# Altium project ESC 2.0.PrjPcb
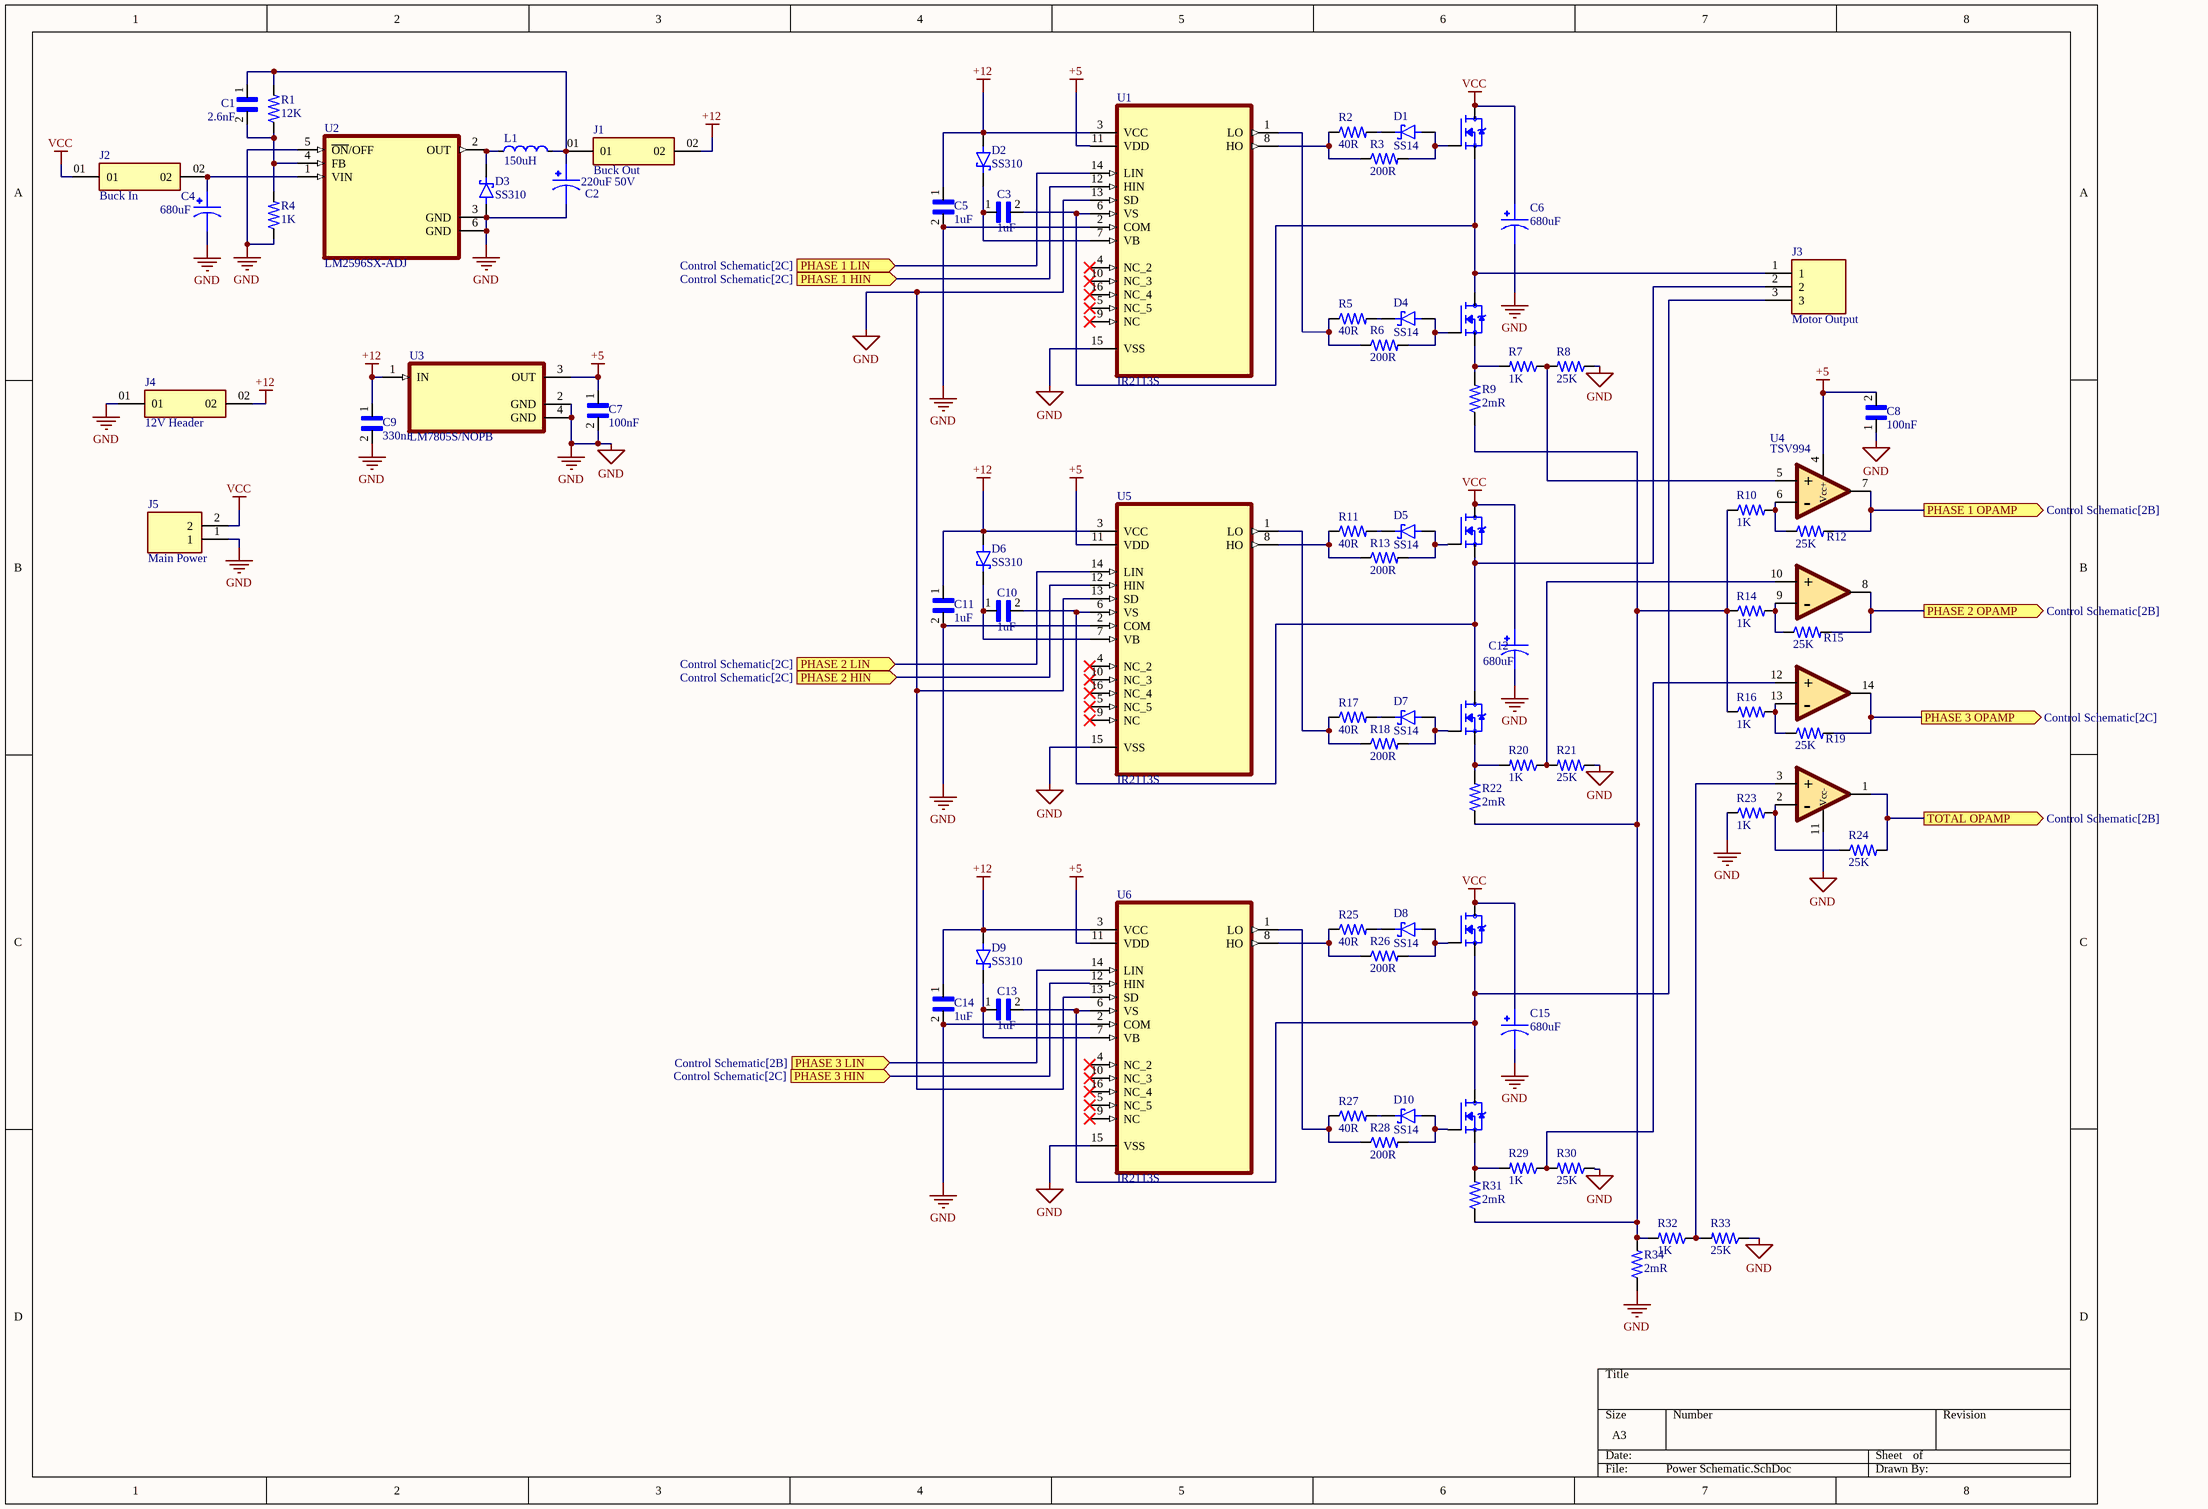
[diagram p0: Power Schematic.SchDoc]
2 sheets, 99 parts. Net scope: flat (ports and power ports of the same name join across sheets).
Board file: ESC PCB.PcbDoc
Sheets:
  Power Schematic.SchDoc
  Control Schematic.SchDoc

## Sheet Power Schematic.SchDoc
size A3; SheetNumber: 1; SheetTotal: 2

### Parts
C1  2.6nF  [0603 Footprint]
C2  220uF 50V  [CAPAE1030X1080N_UWT1H221MNL1GS]
C3  1uF  [0603 Footprint]
C4  680uF  [CAPPRD750W80D1600H2500]
C5  1uF  [0603 Footprint]
C6  680uF  [CAPPRD750W80D1600H2500]
C7  100nF  [0603 Footprint]
C8  100nF  [0603 Footprint]
C9  330nF  [0603 Footprint]
C10  1uF  [0603 Footprint]
C11  1uF  [0603 Footprint]
C12  680uF  [CAPPRD750W80D1600H2500]
C13  1uF  [0603 Footprint]
C14  1uF  [0603 Footprint]
C15  680uF  [CAPPRD750W80D1600H2500]
D1  SS14  [DIOM4325X250N]
D2  SS310  [DIO_SS310]
D3  SS310  [DIO_SS310]
D4  SS14  [DIOM4325X250N]
D5  SS14  [DIOM4325X250N]
D6  SS310  [DIO_SS310]
D7  SS14  [DIOM4325X250N]
D8  SS14  [DIOM4325X250N]
D9  SS310  [DIO_SS310]
D10  SS14  [DIOM4325X250N]
J1  Buck Out  [SAMTEC_MTMM-101-10-G-D-135]
J2  Buck In  [SAMTEC_MTMM-101-10-G-D-135]
J3  Motor Output  [PHOENIX_MKDSN2,5/3-5.08]
J4  12V Header  [SAMTEC_MTMM-101-10-G-D-135]
J5  Main Power  [PHOENIX_1729128]
L1  150uH  [SMD 15x15]
Q1  IRF540NPBF  [TO254P1054X469X1930-3]  (value not drawn)
Q2  IRF540NPBF  [TO254P1054X469X1930-3]  (value not drawn)
Q3  IRF540NPBF  [TO254P1054X469X1930-3]  (value not drawn)
Q4  IRF540NPBF  [TO254P1054X469X1930-3]  (value not drawn)
Q5  IRF540NPBF  [TO254P1054X469X1930-3]  (value not drawn)
Q6  IRF540NPBF  [TO254P1054X469X1930-3]  (value not drawn)
R1  12K  [0603 Footprint]
R2  40R  [0603 Footprint]
R3  200R  [0603 Footprint]
R4  1K  [0603 Footprint]
R5  40R  [0603 Footprint]
R6  200R  [0603 Footprint]
R7  1K  [0603 Footprint]
R8  25K  [0603 Footprint]
R9  2mR  [2512 Footprint]
R10  1K  [0603 Footprint]
R11  40R  [0603 Footprint]
R12  25K  [0603 Footprint]
R13  200R  [0603 Footprint]
R14  1K  [0603 Footprint]
R15  25K  [0603 Footprint]
R16  1K  [0603 Footprint]
R17  40R  [0603 Footprint]
R18  200R  [0603 Footprint]
R19  25K  [0603 Footprint]
R20  1K  [0603 Footprint]
R21  25K  [0603 Footprint]
R22  2mR  [2512 Footprint]
R23  1K  [0603 Footprint]
R24  25K  [0603 Footprint]
R25  40R  [0603 Footprint]
R26  200R  [0603 Footprint]
R27  40R  [0603 Footprint]
R28  200R  [0603 Footprint]
R29  1K  [0603 Footprint]
R30  25K  [0603 Footprint]
R31  2mR  [2512 Footprint]
R32  1K  [0603 Footprint]
R33  25K  [0603 Footprint]
R34  2mR  [2512 Footprint]
U1  IR2113S  [IR2113S]
U2  LM2596SX-ADJ  [VREG_LM2596SX-ADJ]
U3  LM7805S/NOPB  [TO254P1524X483-4N]
U4  TSV994  [TSV994IDT]
U5  IR2113S  [IR2113S]
U6  IR2113S  [IR2113S]

### Ports
PHASE 1 HIN (in, see Control Schematic[2C]), PHASE 1 LIN (in, see Control Schematic[2C]), PHASE 1 OPAMP (out, see Control Schematic[2B]), PHASE 2 HIN (in, see Control Schematic[2C]), PHASE 2 LIN (in, see Control Schematic[2C]), PHASE 2 OPAMP (out, see Control Schematic[2B]), PHASE 3 HIN (in, see Control Schematic[2C]), PHASE 3 LIN (in, see Control Schematic[2B]), PHASE 3 OPAMP (out, see Control Schematic[2C]), TOTAL OPAMP (out, see Control Schematic[2B])

### Nets
+5: C7.1 C8.2 U1.11(VDD) U3.3(OUT) U4.4(Vcc+) U5.11(VDD) U6.11(VDD)
+12: C5.1 C9.1 C11.1 C14.1 D2.A D6.A D9.A J1.02 J4.02 U1.3(VCC) U3.1(IN) U5.3(VCC) U6.3(VCC)
GND: C2.2 C4.2 C5.2 C6.2 C7.2 C8.1 C9.2 C11.2 C12.2 C14.2 C15.2 D3.A J4.01 J5.1 R4.1 R8.1 R21.1 R23.1 R30.1 R33.1 R34.1 U1.2(COM) U1.13(SD) U1.15(VSS) U2.3(GND) U2.5(~{ON}/OFF) U2.6(GND) U3.2(GND) U3.4(GND) U4.11(Vcc-) U5.2(COM) U5.13(SD) U5.15(VSS) U6.2(COM) U6.13(SD) U6.15(VSS)
VCC: C6.1 C12.1 C15.1 J2.01 J5.2 Q1.2(D) Q3.2(D) Q5.2(D)
NetC1_1: C1.1 C2.1 J1.01 L1.2 R1.2
NetC1_2: C1.2 R1.1 R4.2 U2.4(FB)
NetC3_1: C3.1 D2.C(K) U1.7(VB)
NetC3_2: C3.2 J3.1 Q1.3(S) Q2.2(D) U1.6(VS)
NetC4_1: C4.1 J2.02 U2.1(VIN)
NetC10_1: C10.1 D6.C(K) U5.7(VB)
NetC10_2: C10.2 J3.2 Q3.3(S) Q4.2(D) U5.6(VS)
NetC13_1: C13.1 D9.C(K) U6.7(VB)
NetC13_2: C13.2 J3.3 Q5.3(S) Q6.2(D) U6.6(VS)
NetD1_A: D1.A Q1.1(G) R3.2
NetD1_C: D1.C(K) R2.2
NetD3_C: D3.C(K) L1.1 U2.2(OUT)
NetD4_A: D4.A Q2.1(G) R6.2
NetD4_C: D4.C(K) R5.2
NetD5_A: D5.A Q3.1(G) R13.2
NetD5_C: D5.C(K) R11.2
NetD7_A: D7.A Q4.1(G) R18.2
NetD7_C: D7.C(K) R17.2
NetD8_A: D8.A Q5.1(G) R26.2
NetD8_C: D8.C(K) R25.2
NetD10_A: D10.A Q6.1(G) R28.2
NetD10_C: D10.C(K) R27.2
NetQ2_3: Q2.3(S) R7.2 R9.2
NetQ4_3: Q4.3(S) R20.2 R22.2
NetQ6_3: Q6.3(S) R29.2 R31.2
NetR2_1: R2.1 R3.1 U1.8(HO)
NetR5_1: R5.1 R6.1 U1.1(LO)
NetR7_1: R7.1 R8.2 U4.5(+)
NetR9_1: R9.1 R10.1 R14.1 R16.1 R22.1 R31.1 R32.2 R34.2
NetR10_2: R10.2 R12.1 U4.6(-)
NetR11_1: R11.1 R13.1 U5.8(HO)
NetR12_2: R12.2 U4.7(Out) ; port PHASE 1 OPAMP
NetR14_2: R14.2 R15.1 U4.9(-)
NetR15_2: R15.2 U4.8(Out) ; port PHASE 2 OPAMP
NetR16_2: R16.2 R19.1 U4.13(-)
NetR17_1: R17.1 R18.1 U5.1(LO)
NetR19_2: R19.2 U4.14(Out) ; port PHASE 3 OPAMP
NetR20_1: R20.1 R21.2 U4.10(+)
NetR23_2: R23.2 R24.1 U4.2(-)
NetR24_2: R24.2 U4.1(Out) ; port TOTAL OPAMP
NetR25_1: R25.1 R26.1 U6.8(HO)
NetR27_1: R27.1 R28.1 U6.1(LO)
NetR29_1: R29.1 R30.2 U4.12(+)
NetR32_1: R32.1 R33.2 U4.3(+)
NetU1_12: U1.12(HIN) ; port PHASE 1 HIN
NetU1_14: U1.14(LIN) ; port PHASE 1 LIN
NetU5_12: U5.12(HIN) ; port PHASE 2 HIN
NetU5_14: U5.14(LIN) ; port PHASE 2 LIN
NetU6_12: U6.12(HIN) ; port PHASE 3 HIN
NetU6_14: U6.14(LIN) ; port PHASE 3 LIN

Not connected (* = marked no-connect by the designer): U1 4(NC_2)* 5(NC_5)* 9(NC)* 10(NC_3)* 16(NC_4)*; U5 4(NC_2)* 5(NC_5)* 9(NC)* 10(NC_3)* 16(NC_4)*; U6 4(NC_2)* 5(NC_5)* 9(NC)* 10(NC_3)* 16(NC_4)*

### Library data of the parts
C1 = 2.6nF: 2.6nF 0603; MP: CL10A105KA8NNNC; MF: Samsung Electro-Mechanics; Arrow_Electronics-Purchase-URL: https://snapeda.com/shop?store=Arrow+Electronics&id=3597973; Value: *; Arrow_Europe-Purchase-URL: https://snapeda.com/shop?store=Arrow+Europe&id=3597973; SnapEDA_Link: https://www.snapeda.com/parts/CL10A105KA8NNNC/Samsung%20Electro-Mechanics/view-part/3597973/?ref=snap; Digi-Key_Part_Number: 1276-1102-1-ND; Package: 0603 Samsung; DigiKey-Purchase-URL: https://snapeda.com/shop?store=DigiKey&id=3597973
C2 = 220uF 50V: 220ÂµF 50V Aluminum Electrolytic Capacitors Radial, Can - SMD 1000 Hrs @ 105Â°C; MF: Nichicon; MP: UWT1H221MNL1GS; Package: Radial Nichicon; Price: None; Availability: Unavailable; SnapEDA_Link: https://www.snapeda.com/parts/UWT1H221MNL1GS/Nichicon/view-part/566503/?ref=snap; Value: *
C3 C5 C10 C11 C13 C14 = 1uF: 1ÂµF Â±10% 25V Ceramic Capacitor X5R 0603 (1608 Metric); MP: CL10A105KA8NNNC; MF: Samsung Electro-Mechanics; Arrow_Electronics-Purchase-URL: https://snapeda.com/shop?store=Arrow+Electronics&id=3597973; Value: *; Arrow_Europe-Purchase-URL: https://snapeda.com/shop?store=Arrow+Europe&id=3597973; SnapEDA_Link: https://www.snapeda.com/parts/CL10A105KA8NNNC/Samsung%20Electro-Mechanics/view-part/3597973/?ref=snap; Digi-Key_Part_Number: 1276-1102-1-ND; Package: 0603 Samsung; DigiKey-Purchase-URL: https://snapeda.com/shop?store=DigiKey&id=3597973
C4 C6 C12 C15 = 680uF: 680uF 100V 64mΩ@100kHz ±20% 1.41A@100kHz. Aluminum Electrolytic; MP: 478CKS010M; MF: Illinois Capacitor; SnapEDA_Link: https://www.snapeda.com/parts/478CKS010M/Illinois%20Capacitor/view-part/2347563/?ref=snap; Price: None; Mouser-Purchase-URL: https://snapeda.com/shop?store=Mouser&id=2347563; Availability: Warning; Package: Radial Illinois Capacitor; Value: *
C7 C8 = 100nF: 0.1ÂµF Â±10% 50V Ceramic Capacitor X7R 0603 _1608 Metric_; MP: CL10B104KB8NNNC; MF: Samsung Electro-Mechanics; Price: None; SnapEDA_Link: https://www.snapeda.com/parts/CL10B104KB8NNNC/Samsung%20Electro-Mechanics/view-part/3598309/?ref=snap; Availability: Unavailable; Package: 0603 Samsung; Value: *
C9 = 330nF: 330nF 0603; MP: CL10B104KB8NNNC; MF: Samsung Electro-Mechanics; Price: None; SnapEDA_Link: https://www.snapeda.com/parts/CL10B104KB8NNNC/Samsung%20Electro-Mechanics/view-part/3598309/?ref=snap; Availability: Unavailable; Package: 0603 Samsung; Value: *
D2 D3 D6 D9 = SS310: 3A, 100V, Schottky Rectifier; MF: Taiwan Semiconductor; SnapEDA_Link: https://www.snapeda.com/parts/SS310/Taiwan+Semiconductor/view-part/?ref=snap; Package: DO-214AB-2 Taiwan Semiconductor; Value: *; MP: SS310; Check_prices: https://www.snapeda.com/parts/SS310/Taiwan+Semiconductor/view-part/?ref=eda
J1 J2 J4 = 2 Pin Header: Connector Header Through Hole 2 position; MF: Samtec; MP: MTMM-101-10-G-D-135; Availability: In Stock; Value: *; Price: None; Check_prices: https://www.snapeda.com/parts/MTMM-101-10-G-D-135/Samtec/view-part/?ref=eda; Package: None; Purchase-URL: https://pricing.snapeda.com/search/part/MTMM-101-10-G-D-135/?ref=eda; SnapEDA_Link: https://www.snapeda.com/parts/MTMM-101-10-G-D-135/Samtec/view-part/?ref=snap
J3 = 3 Pin Screw Header: HEADER, PCB, SCREW, 5.08MM, 3WAY; Connector Type: PCB; Series: MKDSN 2, 5; Connector Mounting: PCB; Pitch Spacing: 5....; MP: MKDSN2,5/3-5.08; MF: Phoenix Contact; Availability: Not in stock; SnapEDA_Link: https://www.snapeda.com/parts/MKDSN2,5/3-5.08/Phoenix+Contact/view-part/?ref=snap; Package: None; Check_prices: https://www.snapeda.com/parts/MKDSN2,5/3-5.08/Phoenix+Contact/view-part/?ref=eda; Value: *; Price: None
J5 = 2 Pin Screw Header: MF: {'manufacturer': u'Phoenix Contact'}; MP: 1729128; Package: None; Price: None; Value: *; Availability: Unavailable
L1 = 150uH: 150uH Power Inductor / SMD 15mm x 15mm
Q1-Q6 = IRF540NPBF: RoHS Compliant | Low RDS(on) | Industry-leading quality | Dynamic dv/dt Rating | Fast Switching | Fully Avalanche Rated | 175C Operating Temperature; MF: Infineon; SnapEDA_Link: https://www.snapeda.com/parts/IRF540NPBF/Infineon+Technologies/view-part/?ref=snap; Availability: In Stock; MP: IRF540NPBF; Purchase-URL: https://pricing.snapeda.com/search/part/IRF540NPBF/?ref=eda; Price: None; Value: *; Check_prices: https://www.snapeda.com/parts/IRF540NPBF/Infineon+Technologies/view-part/?ref=eda; Package: TO-220 Infineon
R1 = 12K: 12K 0603; MF: Yageo; MP: RC0603FR-071KL; SnapEDA_Link: https://www.snapeda.com/parts/RC0603FR-071KL/Yageo/view-part/?ref=snap; Package: 0603 Yageo; Value: *; Check_prices: https://www.snapeda.com/parts/RC0603FR-071KL/Yageo/view-part/?ref=eda
R2 R5 R11 R17 R25 R27 = 40R: 40R 0603; MF: Yageo; MP: RC0603FR-071KL; SnapEDA_Link: https://www.snapeda.com/parts/RC0603FR-071KL/Yageo/view-part/?ref=snap; Package: 0603 Yageo; Value: *; Check_prices: https://www.snapeda.com/parts/RC0603FR-071KL/Yageo/view-part/?ref=eda
R3 R6 R13 R18 R26 R28 = 200R: 200R 0603; MF: Yageo; MP: RC0603FR-071KL; SnapEDA_Link: https://www.snapeda.com/parts/RC0603FR-071KL/Yageo/view-part/?ref=snap; Package: 0603 Yageo; Value: *; Check_prices: https://www.snapeda.com/parts/RC0603FR-071KL/Yageo/view-part/?ref=eda
R4 R7 R10 R14 R16 R20 R23 R29 R32 = 1K: 1 kOhms Â±1% 0.1W, 1/10W Chip Resistor 0603 (1608 Metric) Moisture Resistant Thick Film; MF: Yageo; MP: RC0603FR-071KL; SnapEDA_Link: https://www.snapeda.com/parts/RC0603FR-071KL/Yageo/view-part/?ref=snap; Package: 0603 Yageo; Value: *; Check_prices: https://www.snapeda.com/parts/RC0603FR-071KL/Yageo/view-part/?ref=eda
R8 R12 R15 R19 R21 R24 R30 R33 = 25K: 25K Ohm 0603; MF: Yageo; MP: RC0603FR-071KL; SnapEDA_Link: https://www.snapeda.com/parts/RC0603FR-071KL/Yageo/view-part/?ref=snap; Package: 0603 Yageo; Value: *; Check_prices: https://www.snapeda.com/parts/RC0603FR-071KL/Yageo/view-part/?ref=eda
R9 R22 R31 R34 = 2mR: RLP73K 3A R16 5% 2K RL; MP: 3-2176058-0; Package: None; Price: None; Value: *; Availability: Unavailable
U1 U5 U6 = IR2113S: Half-Bridge Gate Driver IC Non-Inverting 16-SOIC; MF: Infineon Technologies; Value: *; SnapEDA_Link: https://www.snapeda.com/parts/IR2113S/Infineon%20Technologies/view-part/577803/?ref=snap; Package: SOIC-16 Infineon; MP: IR2113S; Availability: Unavailable; Price: None
U2 = LM2596SX-ADJ: SIMPLE SWITCHER&reg; 4.5V to 40V, 3A Low Component Count Step-Down Regulator 5-DDPAK/TO-263 -40 to 125; MF: Texas Instruments; Check_prices: https://www.snapeda.com/parts/LM2596SX-ADJ/Texas+Instruments/view-part/?ref=eda; Value: *; Availability: In Stock; MP: LM2596SX-ADJ; Price: None; Package: TO-263-5 Texas Instruments; SnapEDA_Link: https://www.snapeda.com/parts/LM2596SX-ADJ/Texas+Instruments/view-part/?ref=snap; Purchase-URL: https://pricing.snapeda.com/search/part/LM2596SX-ADJ/?ref=eda
U3 = LM7805S/NOPB: 1.5-A, 30-V, linear voltage regulator; MF: Texas Instruments; Check_prices: https://www.snapeda.com/parts/LM7805S/NOPB/Texas+Instruments/view-part/?ref=eda; Value: *; Availability: In Stock; MP: LM7805S/NOPB; Price: None; Package: TO-263-3 Texas Instruments; SnapEDA_Link: https://www.snapeda.com/parts/LM7805S/NOPB/Texas+Instruments/view-part/?ref=snap; Purchase-URL: https://pricing.snapeda.com/search/part/LM7805S/NOPB/?ref=eda
D1 D4 D5 D7 D8 D10 = SS14: Value: *; Availability: Unavailable; Price: None; Package: None; MP: SS14

## Sheet Control Schematic.SchDoc
size A4; SheetNumber: 2; SheetTotal: 2
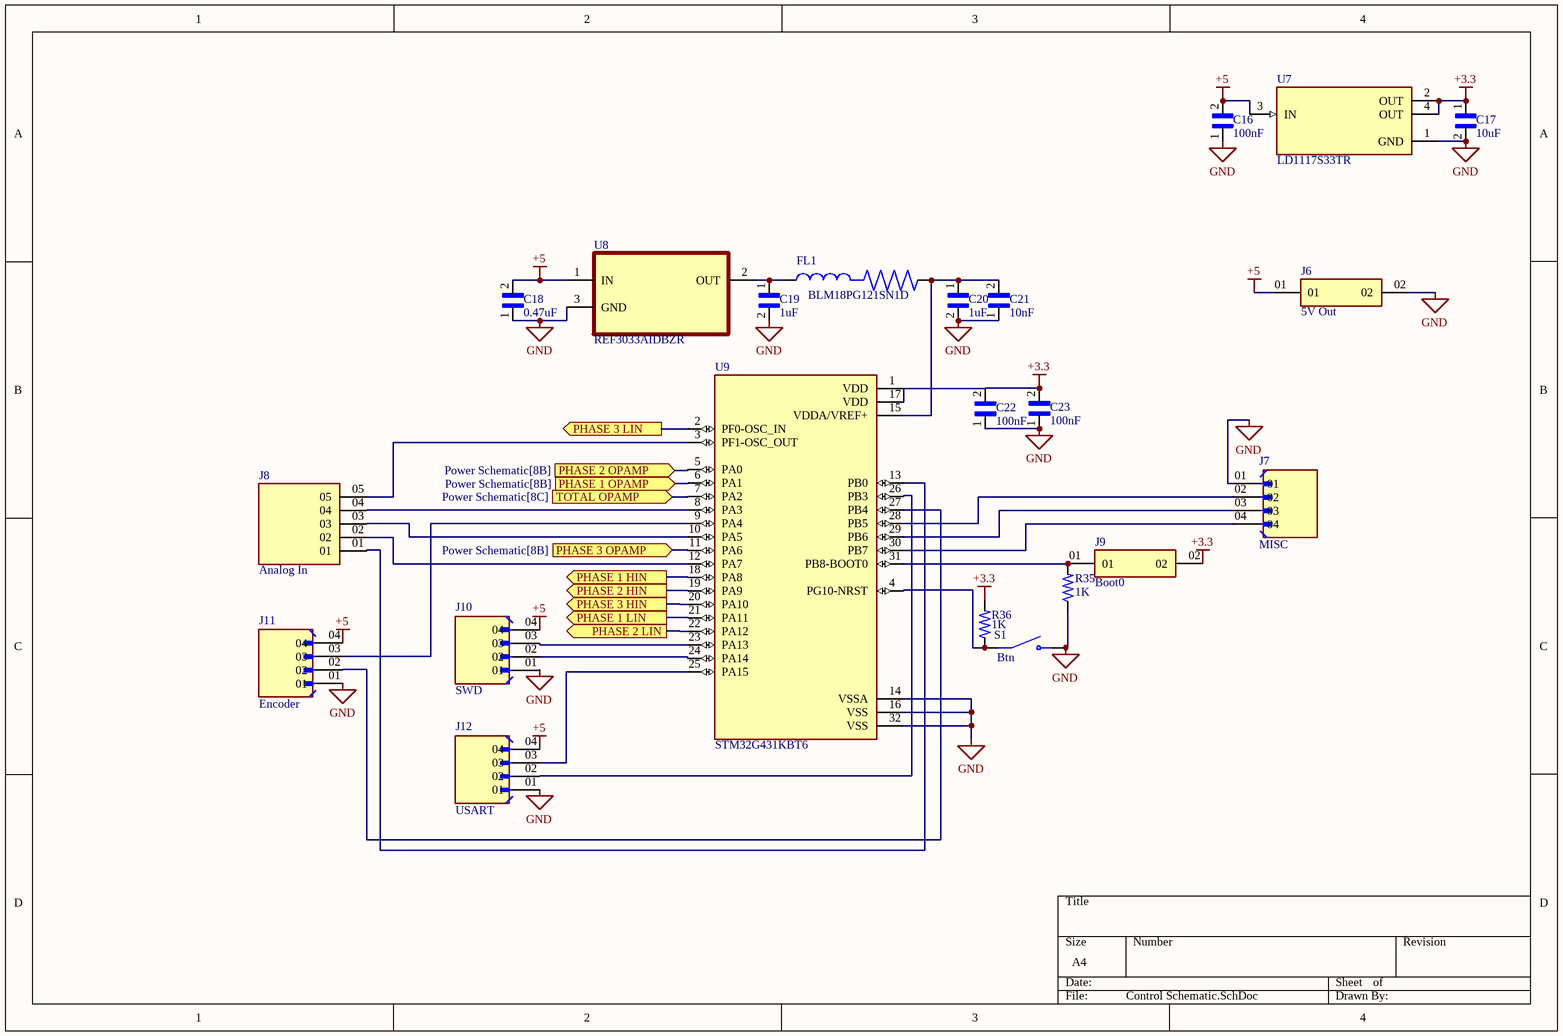
[diagram p1: Control Schematic.SchDoc]

### Parts
C16  100nF  [0603 Footprint]
C17  10uF  [0402 Footprint]
C18  0.47uF  [0603 Footprint]
C19  1uF  [0603 Footprint]
C20  1uF  [0603 Footprint]
C21  10nF  [0402 Footprint]
C22  100nF  [0603 Footprint]
C23  100nF  [0603 Footprint]
FL1  BLM18PG121SN1D  [0603 Footprint]
J6  5V Out  [SAMTEC_MTMM-101-10-G-D-135]
J7  MISC  [WURTH_61300411121]
J8  Analog In  [SAMTEC_TLW-105-06-T-S]
J9  Boot0  [SAMTEC_MTMM-101-10-G-D-135]
J10  SWD  [WURTH_61300411121]
J11  Encoder  [WURTH_61300411121]
J12  USART  [WURTH_61300411121]
R35  1K  [0603 Footprint]
R36  1K  [0603 Footprint]
S1  Btn  [SW_3-1437565-0]
U7  LD1117S33TR  [SOT230P700X180-4N]
U8  REF3033AIDBZR  [SOT95P237X112-3N]
U9  STM32G431KBT6  [QFP80P900X900X160-32N]

### Ports
PHASE 1 HIN (out, see Power Schematic[4A]), PHASE 1 LIN (out, see Power Schematic[4A]), PHASE 1 OPAMP (in, see Power Schematic[8B]), PHASE 2 HIN (out, see Power Schematic[4B]), PHASE 2 LIN (out, see Power Schematic[4B]), PHASE 2 OPAMP (in, see Power Schematic[8B]), PHASE 3 HIN (out, see Power Schematic[4C]), PHASE 3 LIN (out, see Power Schematic[4C]), PHASE 3 OPAMP (in, see Power Schematic[8B]), TOTAL OPAMP (in, see Power Schematic[8C])

### Nets
+3.3: C17.1 C22.2 C23.2 J9.02 R36.2 U7.2(OUT) U7.4(OUT) U9.1(VDD) U9.17(VDD)
+5: C16.2 C18.2 J6.01 J10.04 J11.04 J12.04 U7.3(IN) U8.1(IN)
GND: C16.1 C17.2 C18.1 C19.2 C20.2 C21.1 C22.1 C23.1 J6.02 J7.01 J10.01 J11.01 J12.01 R35.1 S1.3(NO) S1.4(NO) U7.1(GND) U8.3(GND) U9.14(VSSA) U9.16(VSS) U9.32(VSS)
NetC19_1: C19.1 FL1.1 U8.2(OUT)
NetC20_1: C20.1 C21.2 FL1.2 U9.15(VDDA/VREF+)
NetJ7_02: J7.02 U9.28(PB5)
NetJ7_03: J7.03 U9.29(PB6)
NetJ7_04: J7.04 U9.30(PB7)
NetJ8_01: J8.01 U9.13(PB0)
NetJ8_02: J8.02 U9.12(PA7)
NetJ8_03: J8.03 U9.10(PA5)
NetJ8_04: J8.04 U9.8(PA3)
NetJ8_05: J8.05 U9.3(PF1-OSC_OUT)
NetJ9_01: J9.01 R35.2 U9.31(PB8-BOOT0)
NetJ10_02: J10.02 U9.24(PA14)
NetJ10_03: J10.03 U9.23(PA13)
NetJ11_02: J11.02 U9.27(PB4)
NetJ11_03: J11.03 U9.9(PA4)
NetJ12_02: J12.02 U9.26(PB3)
NetJ12_03: J12.03 U9.25(PA15)
NetR12_2: U9.6(PA1) ; port PHASE 1 OPAMP
NetR15_2: U9.5(PA0) ; port PHASE 2 OPAMP
NetR19_2: U9.11(PA6) ; port PHASE 3 OPAMP
NetR24_2: U9.7(PA2) ; port TOTAL OPAMP
NetR36_1: R36.1 S1.1(COM) S1.2(COM) U9.4(PG10-NRST)
NetU1_12: U9.18(PA8) ; port PHASE 1 HIN
NetU1_14: U9.21(PA11) ; port PHASE 1 LIN
NetU5_12: U9.19(PA9) ; port PHASE 2 HIN
NetU5_14: U9.22(PA12) ; port PHASE 2 LIN
NetU6_12: U9.20(PA10) ; port PHASE 3 HIN
NetU6_14: U9.2(PF0-OSC_IN) ; port PHASE 3 LIN

### Library data of the parts
C16 C22 C23 = 100nF: as C7 on sheet Power Schematic; Price: None; SnapEDA_Link: https://www.snapeda.com/parts/CL10B104KB8NNNC/Samsung%20Electro-Mechanics/view-part/3598309/?ref=snap; Availability: Unavailable; Package: 0603 Samsung; Value: *
C17 = 10uF: 10ÂµF Â±20% 6.3V Ceramic Capacitor X5R 0402 (1005 Metric); MF: Samsung; MP: CL05A106MQ5NUNC; SnapEDA_Link: https://www.snapeda.com/parts/CL05A106MQ5NUNC/Samsung/view-part/3597832/?ref=snap; Value: *; Availability: Good; Package: 0402 Samsung; DigiKey-Purchase-URL: https://snapeda.com/shop?store=DigiKey&id=3597832; Arrow_Electronics-Purchase-URL: https://snapeda.com/shop?store=Arrow+Electronics&id=3597832; Price: None
C18 = 0.47uF: 0.47ÂµF Â±10% 25V Ceramic Capacitor X7R 0603 (1608 Metric); MP: CL10B474KA8NFNC; MF: Samsung Electro-Mechanics; Check_prices: https://www.snapeda.com/parts/CL10B474KA8NFNC/Samsung%20Electro-Mechanics/view-part/3599462/?ref=eda; Purchase-URL: https://pricing.snapeda.com/search/part/CL10B474KA8NFNC/?ref=eda; Availability: Warning; Package: 0603 Samsung; Price: None; SnapEDA_Link: https://www.snapeda.com/parts/CL10B474KA8NFNC/Samsung%20Electro-Mechanics/view-part/3599462/?ref=snap; Value: *
C19 C20 = 1uF: as C3 on sheet Power Schematic; Arrow_Electronics-Purchase-URL: https://snapeda.com/shop?store=Arrow+Electronics&id=3597973; Value: *; Arrow_Europe-Purchase-URL: https://snapeda.com/shop?store=Arrow+Europe&id=3597973; SnapEDA_Link: https://www.snapeda.com/parts/CL10A105KA8NNNC/Samsung%20Electro-Mechanics/view-part/3597973/?ref=snap; Digi-Key_Part_Number: 1276-1102-1-ND; Package: 0603 Samsung; DigiKey-Purchase-URL: https://snapeda.com/shop?store=DigiKey&id=3597973
C21 = 10nF: 25V 10nF X7R ±10% 0402 Multilayer Ceramic Capacitors MLCC - SMD/SMT ROHS; MP: CL10B474KA8NFNC; MF: Samsung Electro-Mechanics; Check_prices: https://www.snapeda.com/parts/CL10B474KA8NFNC/Samsung%20Electro-Mechanics/view-part/3599462/?ref=eda; Purchase-URL: https://pricing.snapeda.com/search/part/CL10B474KA8NFNC/?ref=eda; Availability: Warning; Package: 0603 Samsung; Price: None; SnapEDA_Link: https://www.snapeda.com/parts/CL10B474KA8NFNC/Samsung%20Electro-Mechanics/view-part/3599462/?ref=snap; Value: *
FL1 = BLM18PG121SN1D: 120 Ohms @ 100MHz 1 Power Line Ferrite Bead 0603 _1608 Metric_ 2A 50mOhm; MF: Murata; Package: 1608 Murata; Digi-Key_Purchase_URL: https://www.digikey.com/product-detail/en/murata-electronics/BLM18PG121SN1D/490-1037-1-ND/584485?utm_source=snapeda&utm_medium=aggregator&utm_campaign=symbol; Value: *; MP: BLM18PG121SN1D; SnapEDA_Link: https://www.snapeda.com/parts/BLM18PG121SN1D/Murata/view-part/12271/?ref=snap; Digi-Key_Part_Number: 490-1037-1-ND
J6 J9 = 2 Pin Header: as J1 on sheet Power Schematic; Availability: In Stock; Value: *; Price: None; Check_prices: https://www.snapeda.com/parts/MTMM-101-10-G-D-135/Samtec/view-part/?ref=eda; Package: None; Purchase-URL: https://pricing.snapeda.com/search/part/MTMM-101-10-G-D-135/?ref=eda; SnapEDA_Link: https://www.snapeda.com/parts/MTMM-101-10-G-D-135/Samtec/view-part/?ref=snap
J7 J10-J12 = 4 Pin Header: Connector Header Through Hole 4 position 0.100 (2.54mm); MF: Wurth Electronics; MP: 61300411121; SnapEDA_Link: https://www.snapeda.com/parts/61300411121/Wurth+Electronics+Inc./view-part/?ref=snap; Package: None; Value: *; Check_prices: https://www.snapeda.com/parts/61300411121/Wurth+Electronics+Inc./view-part/?ref=eda
J8 = 5 Pin Header: MP: TLW-105-06-T-S; Package: None; Price: None; Value: *; Availability: Unavailable
R35 R36 = 1K: as R4 on sheet Power Schematic; SnapEDA_Link: https://www.snapeda.com/parts/RC0603FR-071KL/Yageo/view-part/?ref=snap; Package: 0603 Yageo; Value: *; Check_prices: https://www.snapeda.com/parts/RC0603FR-071KL/Yageo/view-part/?ref=eda
S1 = Btn: Switch Tactile OFF (ON) SPST Round Button Gull Wing 0.05A 24VDC 1VA 9.18N SMD T/R / 3-1437565-0; MF: TE Connectivity; MP: 3-1437565-0; Package: SMD-6 Omron Electronics; Purchase-URL: https://pricing.snapeda.com/search/part/3-1437565-0/?ref=eda; Price: None; Value: *; SnapEDA_Link: https://www.snapeda.com/parts/3-1437565-0/TE%20Connectivity/view-part/294084/?ref=snap; Availability: Good
U7 = LD1117S33TR: Linear Voltage Regulator IC Positive Fixed 1 Output 800mA SOT-223; MF: STMicroelectronics; Value: *; SnapEDA_Link: https://www.snapeda.com/parts/LD1117S33TR/STMicroelectronics/view-part/?ref=snap; MP: LD1117S33TR; Purchase-URL: https://pricing.snapeda.com/search/part/LD1117S33TR/?ref=eda; Check_prices: https://www.snapeda.com/parts/LD1117S33TR/STMicroelectronics/view-part/?ref=eda; Availability: In Stock; Price: None; Package: TO-261-4 STMicroelectronics
U8 = REF3033AIDBZR: Series Voltage Reference IC Â±0.2% SOT-23-3; MF: Texas Instruments; Package: SOT-23-3 Texas Instruments; SnapEDA_Link: https://www.snapeda.com/parts/REF3033AIDBZR/Texas%20Instruments/view-part/298602/?ref=snap; Value: *; Price: None; MP: REF3033AIDBZR; Availability: Unavailable
U9 = STM32G431KBT6: ARMÂ® CortexÂ®-M4F STM32G4 Microcontroller IC 32-Bit 170MHz 128KB _128K x 8_ FLASH 32-LQFP _7x7_; MF: STMicroelectronics; Price: None; SnapEDA_Link: https://www.snapeda.com/parts/STM32G431KBT6/STMicroelectronics/view-part/4422336/?ref=snap; MP: STM32G431KBT6; Availability: Unavailable; Value: *; Package: LQFP-32 STMicroelectronics

## Nets that join several sheets
+5: Power Schematic (7 pins), Control Schematic (8 pins)
GND: Power Schematic (36 pins), Control Schematic (21 pins)
NetR12_2: Power Schematic (R12.2 U4.7), Control Schematic (U9.6)
NetR15_2: Power Schematic (R15.2 U4.8), Control Schematic (U9.5)
NetR19_2: Power Schematic (R19.2 U4.14), Control Schematic (U9.11)
NetR24_2: Power Schematic (R24.2 U4.1), Control Schematic (U9.7)
NetU1_12: Power Schematic (U1.12), Control Schematic (U9.18)
NetU1_14: Power Schematic (U1.14), Control Schematic (U9.21)
NetU5_12: Power Schematic (U5.12), Control Schematic (U9.19)
NetU5_14: Power Schematic (U5.14), Control Schematic (U9.22)
NetU6_12: Power Schematic (U6.12), Control Schematic (U9.20)
NetU6_14: Power Schematic (U6.14), Control Schematic (U9.2)